# EAGLE schematic megadonkey_rev0 (EAGLE 4.16)
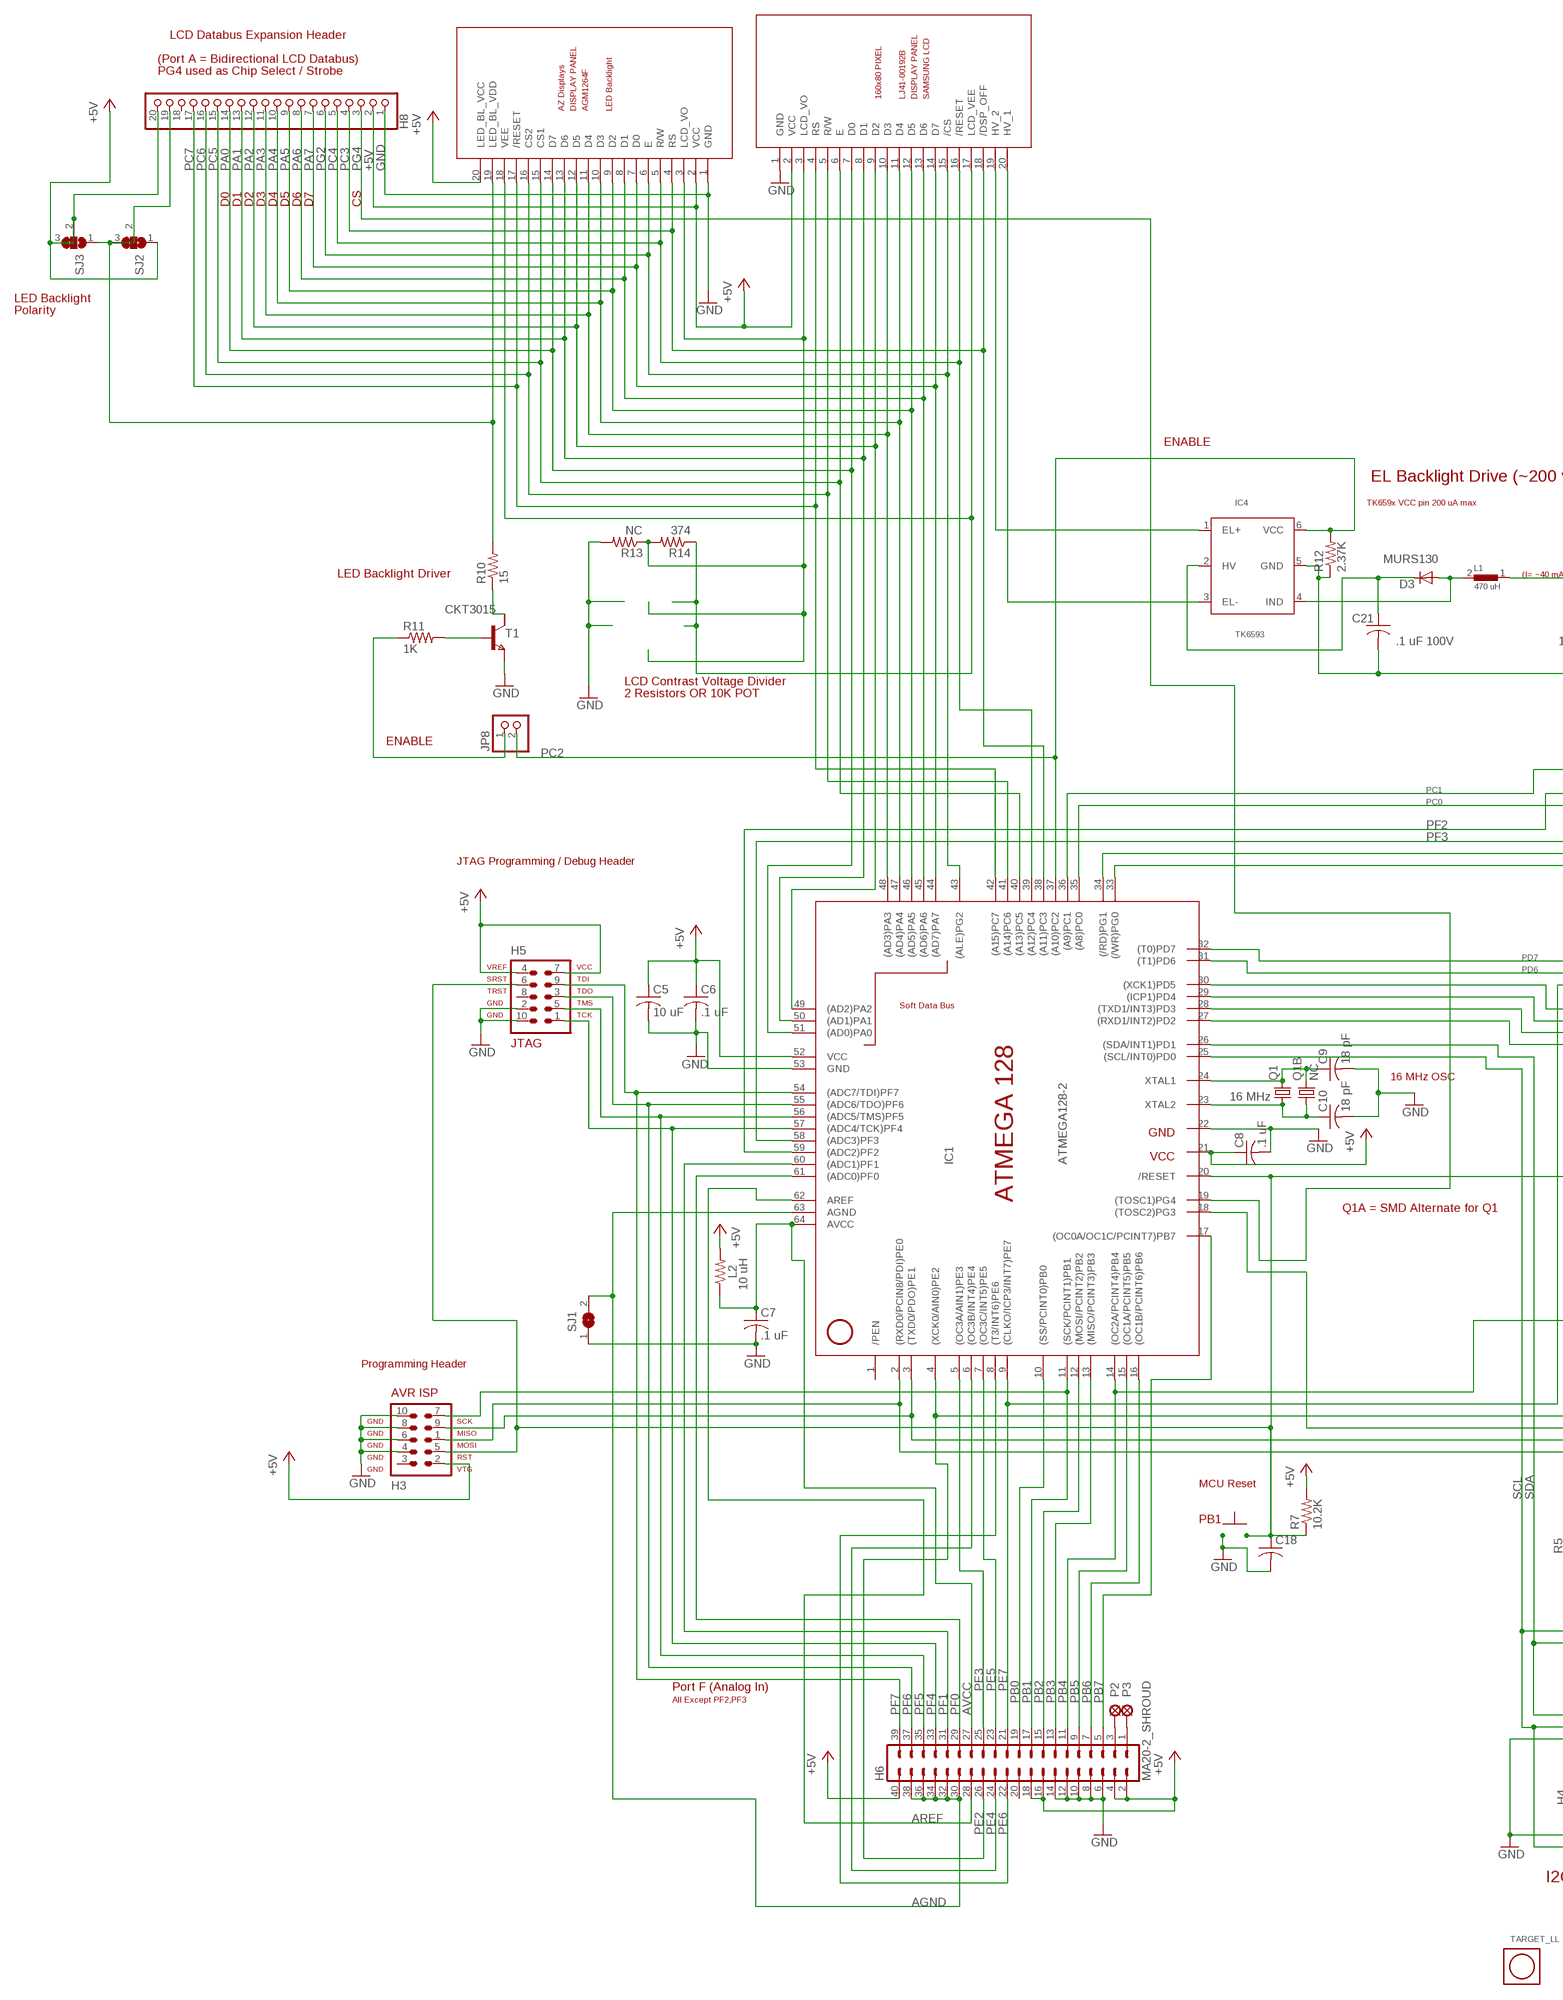
[diagram p0: schematic, sheet 1, part 1 of 2]
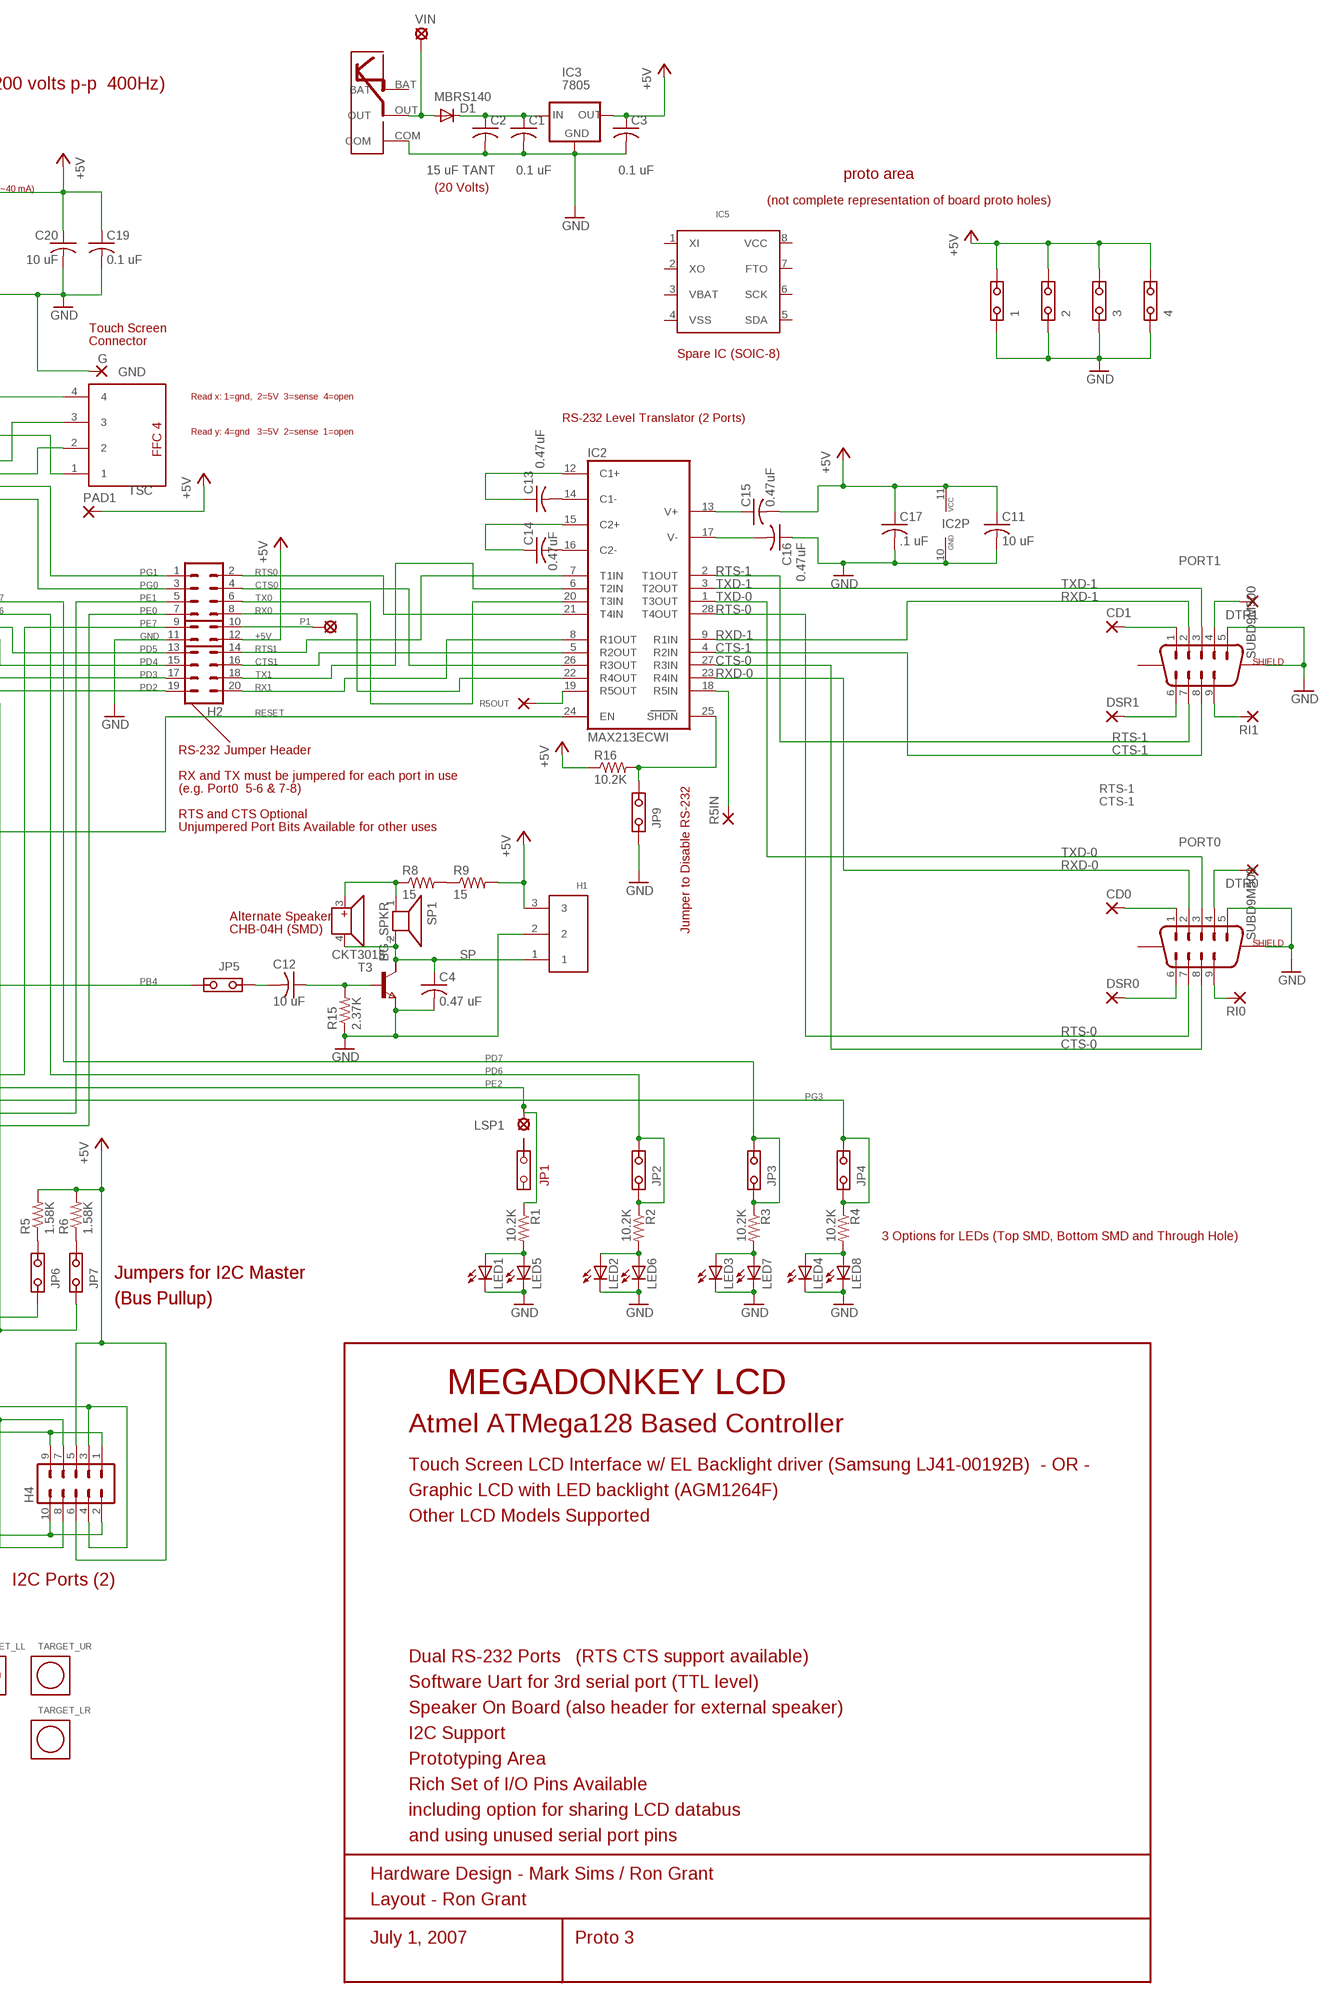
[diagram p1: schematic, sheet 1, part 2 of 2]

## Parts
1  J100-2  [J100-2]
2  J100-2  [J100-2]
3  J100-2  [J100-2]
4  J100-2  [J100-2]
C1  0.1 uF  C-USC0805  [C0805]
C2  15 uF TANT  CAP293D  [SMD2917]
C3  0.1 uF  C-USC0805  [C0805]
C4  0.47 uF  C-USC0805  [C0805]
C5  10 uF  C-USC1206  [C1206]
C6  .1 uF  C-USC0805  [C0805]
C7  .1 uF  C-USC0805  [C0805]
C8  .1 uF  C-USC0805  [C0805]
C9  18 pF  C-USC0805  [C0805]
C10  18 pF  C-USC0805  [C0805]
C11  10 uF  C-USC1206  [C1206]
C12  10 uF  C-USC1206  [C1206]
C13  0.47uF  C-USC0805  [C0805]
C14  0.47uF  C-USC0805  [C0805]
C15  0.47uF  C-USC0805  [C0805]
C16  0.47uF  C-USC0805  [C0805]
C17  .1 uF  C-USC0805  [C0805]
C18  C-USC0805  [C0805]
C19  0.1 uF  C-USC0805  [C0805]
C20  10 uF  C-USC1206  [C1206]
C21  .1 uF 100V  C-USC1206  [C1206]
CD0  1,6/0,9  [1,6/0,9]
CD1  1,6/0,9  [1,6/0,9]
D1  MBRS140  DIODE-SMB  [SMB]
D3  MURS130  DIODE-SMB  [SMB]
DSR0  1,6/0,9  [1,6/0,9]
DSR1  1,6/0,9  [1,6/0,9]
DTR0  1,6/0,9  [1,6/0,9]
DTR1  1,6/0,9  [1,6/0,9]
GND  G  1,6/0,9  [1,6/0,9]
H1  HEADER1X3  [1X03]
H2  MA10-2  [MA10-2]
H3  AVR-ISP-10  [AVR-ISP-10]
H4  MA05-2  [MA05-2]
H5  AVR-JTAG-10  [AVR-JTAG-10]
H6  MA20-2_SHROUD  [MA20X2]
H8  PINHD-1X20  [1X20]
HA  LCD_AGM1264F  [1X20_AGM1264F]
HB  EL_LCD  LCD_LJ41  [1X20P]
IC1  ATMEGA128-2  [TQFP64]
IC2  MAX213ECWI  [SO28L]
IC3  7805  7805_H  [7805H]
IC4  TK6593  [TOKO6_3MM]
IC5  MT41T00S  [SO-8]
JP2  J100-2  [J100-2]
JP3  J100-2  [J100-2]
JP4  J100-2  [J100-2]
JP5  J100-2  [J100-2]
JP6  J100-2  [J100-2]
JP7  J100-2  [J100-2]
JP8  PINHD-1X2  [1X02]
JP9  J100-2  [J100-2]
L1  470 uH  IND470  [SMD550X240]
L2  10 uH  R-US_R1210  [R1210]
LED1  LEDCHIPLED_1206  [CHIPLED_1206]
LED2  LEDCHIPLED_1206  [CHIPLED_1206]
LED3  LEDCHIPLED_1206  [CHIPLED_1206]
LED4  LEDCHIPLED_1206  [CHIPLED_1206]
LED5  LEDSMT1206  [1206]
LED6  LEDSMT1206  [1206]
LED7  LEDSMT1206  [1206]
LED8  LEDSMT1206  [1206]
LSP1  MCS08  [MCS08]
P1  MCS08  [MCS08]
P2  MCS08  [MCS08]
P3  MCS08  [MCS08]
PAD1  1,6/0,9  [1,6/0,9]
PORT0  SUBD9M500  [M09H0500]
PORT1  SUBD9M500  [M09H0500]
Q1  16 MHz  CRYSTALHC49U70  [HC49U70]
Q1B  NC  CRYSTALSM49  [SM49]
R1  10.2K  R-US_M0805  [M0805]
R2  10.2K  R-US_M0805  [M0805]
R3  10.2K  R-US_M0805  [M0805]
R4  10.2K  R-US_M0805  [M0805]
R5  1.58K  R-US_M0805  [M0805]
R5IN  1,6/0,9  [1,6/0,9]
R5OUT  1,6/0,9  [1,6/0,9]
R6  1.58K  R-US_M0805  [M0805]
R7  10.2K  R-US_R0805  [R0805]
R8  15  R-US_M0805  [M0805]
R9  15  R-US_M0805  [M0805]
R10  15  R-US_M0805  [M0805]
R11  1K  R-US_R0805  [R0805]
R12  2.37K  R-US_R0805  [R0805]
R13  NC  R-US_M1206  [M1206]
R14  374  R-US_M1206  [M1206]
R15  2.37K  R-US_R0805  [R0805]
R16  10.2K  R-US_M0805  [M0805]
RI0  1,6/0,9  [1,6/0,9]
RI1  1,6/0,9  [1,6/0,9]
SJ1  SJ  [SJ]
SJ2  SJ2W  [SJ_2]
SJ3  SJ2W  [SJ_2]
SP1  BG_SPKR  [BG_SPKR]
SP2  NC  CHB-04H  [CHB-04H]
T1  CKT3015  NPNSOT223  [SOT223]
T3  CKT3015  NPNSOT223  [SOT223]
TARGET_LL  ALIGNMENT_TARGET_1MM  [1MM_ALIGNMENT_TARGET]
TARGET_LR  ALIGNMENT_TARGET_1MM  [1MM_ALIGNMENT_TARGET]
TARGET_UR  ALIGNMENT_TARGET_1MM  [1MM_ALIGNMENT_TARGET]
TSC  FFC4VERT  [FFC4-VERT]
U$7  POWER_JACK_21  [POWER_21]
VIN  LSP11  [LSP11]

## Nets
+5V [VCC]: 1.1 2.1 3.1 4.1 C3.1 C5.1 C6.1 C8.1 C11.1 C15.2 C17.1 C19.1 C20.1 H1.3 H2.12 H3.2 H4.5 H4.6 H5.4 H5.7 H6.2 H6.4 H6.16 H6.18 H6.40 H8.2 H8.20 HA.2(VCC) HA.20(LED_BL_VCC) HB.2(VCC) IC1.21(VCC1) IC1.52(VCC) IC2.11(VCC) IC3.3(OUT) L1.1 L2.2 PAD1.1(P) R5.2 R6.2 R7.2 R9.2 R16.1 SJ2.1 SJ3.2 SJ3.3
+12V-RS232: C15.1 IC2.13(V+)
AGND: H6.30 H6.32 H6.34 H6.36 H6.38 IC1.63(AGND) SJ1.2
AREF: H6.28 IC1.62(AREF)
AVCC: C7.1 H6.27 IC1.64(AVCC) L2.1
CTS0: H2.4 IC2.26(R3OUT)
CTS1: H2.16 IC2.5(R2OUT)
CTS-0: IC2.27(R3IN) PORT0.8
CTS-1: IC2.4(R2IN) PORT1.8
GND [GND]: 1.2 2.2 3.2 4.2 C1.2 C2.M C3.2 C4.2 C5.2 C6.2 C7.2 C8.2 C9.2 C10.2 C11.2 C16.1 C17.2 C18.2 C19.2 C20.2 C21.2 GND.1(P) H1.2 H2.11 H3.4 H3.6 H3.8 H3.10 H4.1 H4.2 H4.9 H4.10 H5.2 H5.10 H6.6 H6.8 H6.10 H6.12 H6.14 H8.1 HA.1(GND) HB.1(GND) IC1.22(GND1) IC1.53(GND) IC2.10(GND) IC3.2(GND) IC4.5(GND) JP9.2 LED1.C LED2.C LED3.C LED4.C LED5.C LED6.C LED7.C LED8.C PORT0.5 PORT0.G2 PORT1.5 PORT1.G2 R12.1 R13.2 R15.1 SJ1.1 T1.3(E) T3.3(E) U$7.COM
N$1: C13.2 IC2.14(C1-)
N$2: HB.19(HV_2) IC4.1(EL+)
N$6: LED1.A LED5.A R1.2
N$7 [VCC]: D1.A U$7.OUT VIN.MP
N$11: HB.20(HV_1) IC4.3(EL-)
N$15: H2.10 P1.MP
N$17 [GND]: IC2.25(SHDN) JP9.1 R16.2
N$19: C14.2 IC2.16(C2-)
N$20: JP6.1 R5.1
N$21: HA.18(VEE) HB.17(LCD_VEE) R14.1
N$22: C16.2 IC2.17(V-)
N$23: H6.3 P2.MP
N$24: PORT1.9 RI1.1(P)
N$27 [VCC]: H8.19 HA.19(LED_BL_VDD) R10.2 SJ2.2 SJ2.3 SJ3.1
N$30: C12.2 JP5.2
N$31: C12.1 R15.2 T3.1(B)
N$46: C14.1 IC2.15(C2+)
N$48: C13.1 IC2.12(C1+)
N$52: CD1.1(P) PORT1.1
N$53: PORT0.9 RI0.1(P)
N$54: JP7.1 R6.1
N$55: R11.2 T1.1(B)
N$56 [VCC]: C1.1 C2.P D1.C IC3.1(IN)
N$59: R8.2 R9.1
N$61: D3.A IC4.4(IND) L1.2
N$64: C21.1 D3.C IC4.2(HV)
N$82: R10.1 T1.2(C1)
N$84: DSR1.1(P) PORT1.6
N$85: CD0.1(P) PORT0.1
N$86: DTR1.1(P) PORT1.4
N$88: DTR0.1(P) PORT0.4
N$89: DSR0.1(P) PORT0.6
N$110: LED2.A LED6.A R2.2
N$300: LED3.A LED7.A R3.2
N$302: LED4.A LED8.A R4.2
N$343: JP8.1 R11.1
N$361: R8.1 SP1.1 SP2.3(SP+)
N$362: H6.1 P3.MP
PA0: H8.14 HA.14(D7) HB.7(D0) IC1.51((AD0)PA0)
PA1: H8.13 HA.13(D6) HB.8(D1) IC1.50((AD1)PA1)
PA2: H8.12 HA.12(D5) HB.9(D2) IC1.49((AD2)PA2)
PA3: H8.11 HA.11(D4) HB.10(D3) IC1.48((AD3)PA3)
PA4: H8.10 HA.10(D3) HB.11(D4) IC1.47((AD4)PA4)
PA5: H8.9 HA.9(D2) HB.12(D5) IC1.46((AD5)PA5)
PA6: H8.8 HA.8(D1) HB.13(D6) IC1.45((AD6)PA6)
PA7: H8.7 HA.7(D0) HB.14(D7) IC1.44((AD7)PA7)
PB0: H6.19 IC1.10((SS/PCINT0)PB0)
PB1: H3.7 H6.17 IC1.11((SCK/PCINT1)PB1)
PB2: H6.15 IC1.12((MOSI/PCINT2)PB2)
PB3: H6.13 IC1.13((MISO/PCINT3)PB3)
PB4: H6.11 IC1.14((OC2A/PCINT4)PB4) JP5.1
PB5: H6.9 IC1.15((OC1A/PCINT5)PB5)
PB6: H6.7 IC1.16((OC1B/PCINT6)PB6)
PB7: H6.5 IC1.17((OC0A/OC1C/PCINT7)PB7)
PC0: IC1.35((A8)PC0) TSC.1
PC1: IC1.36((A9)PC1) TSC.4
PC2: IC1.37((A10)PC2) IC4.6(VCC) JP8.2 R12.2
PC3: H8.4 HA.4(RS) HB.18(/DSP_OFF) IC1.38((A11)PC3)
PC4: H8.5 HA.5(R/W) HB.16(/RESET) IC1.39((A12)PC4)
PC5: H8.15 HA.15(CS1) HB.6(E) IC1.40((A13)PC5)
PC6: H8.16 HA.16(CS2) HB.5(R/W) IC1.41((A14)PC6)
PC7: H8.17 HA.17(/RESET) HB.4(RS) IC1.42((A15)PC7)
PD2: H2.19 IC1.27((RXD1/INT2)PD2)
PD3: H2.17 IC1.28((TXD1/INT3)PD3)
PD4: H2.15 IC1.29((ICP1)PD4)
PD5: H2.13 IC1.30((XCK1)PD5)
PD6: IC1.31((T1)PD6) JP2.1 JP2.2 R2.1
PD7: IC1.32((T0)PD7) JP3.1 JP3.2 R3.1
PE0: H2.7 H3.1 IC1.2((RXD0/PCIN8/PDI)PE0)
PE1: H2.5 H3.9 IC1.3((TXD0/PDO)PE1)
PE2: H6.26 IC1.4((XCK0/AIN0)PE2) LSP1.MP R1.1
PE3: H6.25 IC1.5((OC3A/AIN1)PE3)
PE4: H6.24 IC1.6((OC3B/INT4)PE4)
PE5: H6.23 IC1.7((OC3C/INT5)PE5)
PE6: H6.22 IC1.8((T3/INT6)PE6)
PE7: H2.9 H6.21 IC1.9((CLKO/ICP3/INT7)PE7)
PF0: H6.29 IC1.61((ADC0)PF0)
PF1: H6.31 IC1.60((ADC1)PF1)
PF2: IC1.59((ADC2)PF2) TSC.3
PF3: IC1.58((ADC3)PF3) TSC.2
PF4: H5.1 H6.33 IC1.57((ADC4/TCK)PF4)
PF5: H5.5 H6.35 IC1.56((ADC5/TMS)PF5)
PF6: H5.3 H6.37 IC1.55((ADC6/TDO)PF6)
PF7: H5.9 H6.39 IC1.54((ADC7/TDI)PF7)
PG0: H2.3 IC1.33((/WR)PG0)
PG1: H2.1 IC1.34((/RD)PG1)
PG2: H8.6 HA.6(E) HB.15(/CS) IC1.43((ALE)PG2)
PG3: IC1.18((TOSC2)PG3) JP4.1 JP4.2 R4.1
PG4: H8.3 IC1.19((TOSC1)PG4)
R5IN: IC2.18(R5IN) R5IN.1(P)
R5OUT: IC2.19(R5OUT) R5OUT.1(P)
RESET: C18.1 H3.5 H5.6 IC1.20(/RESET) IC2.24(EN) R7.1
RTS0: H2.2 IC2.21(T4IN)
RTS1: H2.14 IC2.7(T1IN)
RTS-0: IC2.28(T4OUT) PORT0.7
RTS-1: IC2.2(T1OUT) PORT1.7
RX0: H2.8 IC2.22(R4OUT)
RX1: H2.20 IC2.8(R1OUT)
RXD-0: IC2.23(R4IN) PORT0.2
RXD-1: IC2.9(R1IN) PORT1.2
SCL: H4.7 H4.8 IC1.25((SCL/INT0)PD0) JP6.2
SDA: H4.3 H4.4 IC1.26((SDA/INT1)PD1) JP7.2
SP: C4.1 H1.1 SP1.2 SP2.4(SP-) T3.2(C1)
TX0: H2.6 IC2.20(T3IN)
TX1: H2.18 IC2.6(T2IN)
TXD-0: IC2.1(T3OUT) PORT0.3
TXD-1: IC2.3(T2OUT) PORT1.3
VO: HA.3(LCD_VO) HB.3(LCD_VO) R13.1 R14.2
X1: C9.1 IC1.24(XTAL1) Q1.2 Q1B.2
X2: C10.1 IC1.23(XTAL2) Q1.1 Q1B.1
Unconnected: H3.3 H5.8 H6.20 H8.18 IC1.1(/PEN) IC5.1(XI) IC5.2(XO) IC5.5(SDA) IC5.6(SCK) IC5.7(FTO) PORT0.G1 PORT1.G1 T1.4(C2) T3.4(C2)

## Notes on the sheet
- LCD Databus Expansion Header
- (Port A = Bidirectional LCD Databus)
- PG4 used as Chip Select / Strobe
- D0 | D1 | D2 | D3 | D4 | D5 | D6 | D7 | CS
- LED Backlight
- Polarity
- ENABLE
- EL Backlight Drive (~200 volts p-p  400Hz)
- TK659x VCC pin 200 uA max
- proto area
- LED Backlight Driver | (I= ~40 mA) | (20 Volts)
- (not complete representation of board proto holes)
- LCD Contrast Voltage Divider
- 2 Resistors OR 10K POT
- Touch Screen
- Connector
- Spare IC (SOIC-8)
- ENABLE
- Read x: 1=gnd,  2=5V  3=sense  4=open
- RS-232 Level Translator (2 Ports)
- Read y: 4=gnd   3=5V  2=sense  1=open
- JTAG Programming / Debug Header
- Soft Data Bus
- SHIELD
- ATMEGA 128
- 16 MHz OSC
- RS-232 Jumper Header
- RX and TX must be jumpered for each port in use
- (e.g. Port0  5-6 & 7-8)
- RTS and CTS Optional
- Unjumpered Port Bits Available for other uses
- Q1A = SMD Alternate for Q1
- Alternate Speaker
- CHB-04H (SMD) | Jumper to Disable RS-232
- SHIELD
- Programming Header
- MCU Reset
- JP1
- PB1
- 3 Options for LEDs (Top SMD, Bottom SMD and Through Hole)
- Jumpers for I2C Master | Jumpers for I2C Master
- (Bus Pullup) | (Bus Pullup)
- Port F (Analog In)
- All Except PF2,PF3 | MEGADONKEY LCD
- Atmel ATMega128 Based Controller
- Touch Screen LCD Interface w/ EL Backlight driver (Samsung LJ41-00192B)  - OR -
- Graphic LCD with LED backlight (AGM1264F)
- Other LCD Models Supported
- I2C Ports (2)
- Dual RS-232 Ports   (RTS CTS support available)
- Software Uart for 3rd serial port (TTL level)
- Speaker On Board (also header for external speaker)
- I2C Support
- Prototyping Area
- Rich Set of I/O Pins Available
- including option for sharing LCD databus
- and using unused serial port pins
- Hardware Design - Mark Sims / Ron Grant
- Layout - Ron Grant
- July 1, 2007 | Proto 3

## Power pins joined to a net without a drawn wire
BAT: U$7.BAT
VBAT: IC5.3(VBAT)
VCC: IC5.8(VCC)
VSS: IC5.4(VSS)

## Library data of the parts
1-4 JP2-JP7 JP9 = 2_ronlib:J100-2
C1 C3-C21 = rcl:C-US: CAPACITOR, American symbol
C2 = 2_ronlib:CAP293D
CD0 CD1 DSR0 DSR1 DTR0 DTR1 GND PAD1 R5IN R5OUT RI0 RI1 = wirepad:1,6/0,9: THROUGH-HOLE PAD
D1 D3 = diode:DIODE-: DIODE
H1 = 2_ronlib:HEADER1X3
H2 = con-lstb:MA10-2: PIN HEADER
H3 = atmel_rg:AVR-ISP-10: AVR ISP-10 Serial Programming Header
H4 = con-lstb:MA05-2: PIN HEADER
H5 = atmel:AVR-JTAG-10: AVR JTAG Debug/Programming Header
H6 = 2_ronlib:MA20-2_SHROUD
H8 = pinhead:PINHD-1X20: PIN HEADER
HA = 1_ronlib:LCD_AGM1264F
HB = 1_ronlib:LCD_LJ41
IC1 = atmel-2005:ATMEGA128-2
IC2 = maxim:MAX213ECWI: RS232 TRANSEIVER
IC3 = 2_ronlib:7805_H
IC4 = 2_ronlib:TK6593
IC5 = 2_ronlib:MT41T00S
JP8 = pinhead:PINHD-1X2: PIN HEADER
L1 = 2_ronlib:IND470
L2 R1-R16 = rcl:R-US_: RESISTOR, American symbol
LED1-LED8 = led:LED: LED OSRAM: - CHIPLED LG R971, LG N971, LY N971, LG Q971, LY Q971, LO R971, LY R971 LH N974, LH R974 LS Q976, LO Q976, LY Q976 LO Q996 - Hyper CHIPLED LW Q18S LB Q993, LB Q99A, LB R99A - SideLED LS A670, LO A670, LY A670, LG A670, LP A670 LB A673, LV A673, LT A673, LW A673 LH A674 LY A675 LS A676, LA A676, LO A676, LY A676, LW A676 LS A679, LY A679, LG A679 - Hyper Micro SIDELED® LS Y876, LA Y876, LO Y876, LY Y876 LT Y87S - SmartLED LW L88C, LW L88S LB L89C, LB L89S, LG L890 LS L89K, LO L89K, LY L89K LS L896, LA L896, LO L896, LY L896 - TOPLED LS T670, LO T670, LY T670, LG T670, LP T670 LSG T670, LSP T670, LSY T670, LOP T670, LYG T670 LG T671, LOG T671, LSG T671 LB T673, LV T673, LT T673, LW T673 LH T674 LS T676, LA T676, LO T676, LY T676, LB T676, LH T676, LSB T676, LW T676 LB T67C, LV T67C, LT T67C, LS T67K, LO T67K, LY T67K, LW E67C LS E67B, LA E67B, LO E67B, LY E67B, LB E67C, LV E67C, LT E67C LW T67C LS T679, LY T679, LG T679 LS T770, LO T770, LY T770, LG T770, LP T770 LB T773, LV T773, LT T773, LW T773 LH T774 LS E675, LA E675, LY E675, LS T675 LS T776, LA T776, LO T776, LY T776, LB T776 LHGB T686 LT T68C, LB T68C - Hyper Mini TOPLED® LB M676 - Mini TOPLED Santana® LG M470 LS M47K, LO M47K, LY M47K Source: http://www.osram.convergy.de - LUMILED® LXK2-PW12-R00, LXK2-PW12-S00, LXK2-PW14-U00, LXK2-PW14-V00 LXK2-PM12-R00, LXK2-PM12-S00, LXK2-PM14-U00 LXK2-PE12-Q00, LXK2-PE12-R00, LXK2-PE12-S00, LXK2-PE14-T00, LXK2-PE14-U00 LXK2-PB12-K00, LXK2-PB12-L00, LXK2-PB12-M00, LXK2-PB14-N00, LXK2-PB14-P00, LXK2-PB14-Q00 LXK2-PR12-L00, LXK2-PR12-M00, LXK2-PR14-Q00, LXK2-PR14-R00 LXK2-PD12-Q00, LXK2-PD12-R00, LXK2-PD12-S00 LXK2-PH12-R00, LXK2-PH12-S00 LXK2-PL12-P00, LXK2-PL12-Q00, LXK2-PL12-R00 Source: www.luxeon.com
LSP1 P1-P3 = solpad:MCS08: SOLDER PAD MC S0,8, drill 1.2 mm, distributor Buerklin, 08F130
PORT0 PORT1 = 2_ronlib:SUBD9M500
Q1 Q1B = crystal:CRYSTAL: CRYSTAL
SJ1 = jumper:SJ: SMD solder JUMPER
SJ2 SJ3 = jumper:SJ2W: SMD solder JUMPER
SP1 = 2_ronlib:BG_SPKR
SP2 = 2_ronlib:CHB-04H
T1 T3 = zetex:NPNSOT223: NPN TRANSISTOR
TARGET_LL TARGET_LR TARGET_UR = 2_ronlib:ALIGNMENT_TARGET_1MM
TSC = 2_ronlib:FFC4
U$7 = 1_ronlib:POWER_JACK_21
VIN = solpad:LSP11: SOLDER PAD drill 1.1 mm

## Net classes
1 VCC: width 0.508 mm
2 GND: width 1.016 mm